# Altium schematic sheet DDR_3.SchDoc
size A2
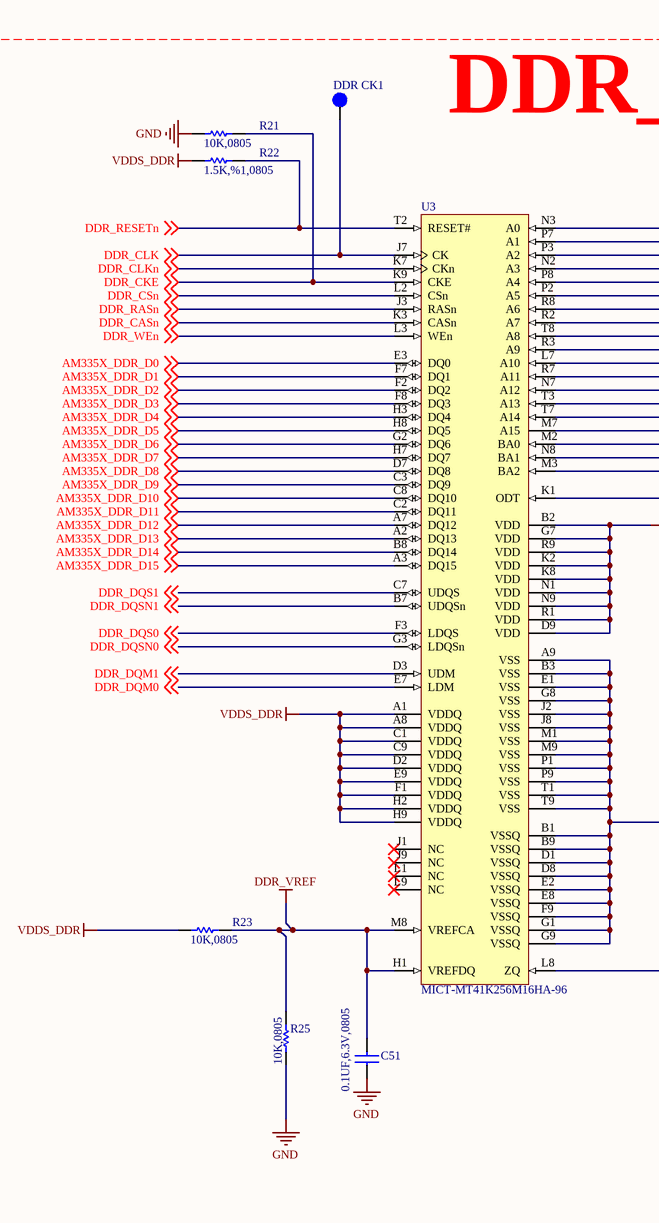
[diagram p0: DDR_3.SchDoc, left]
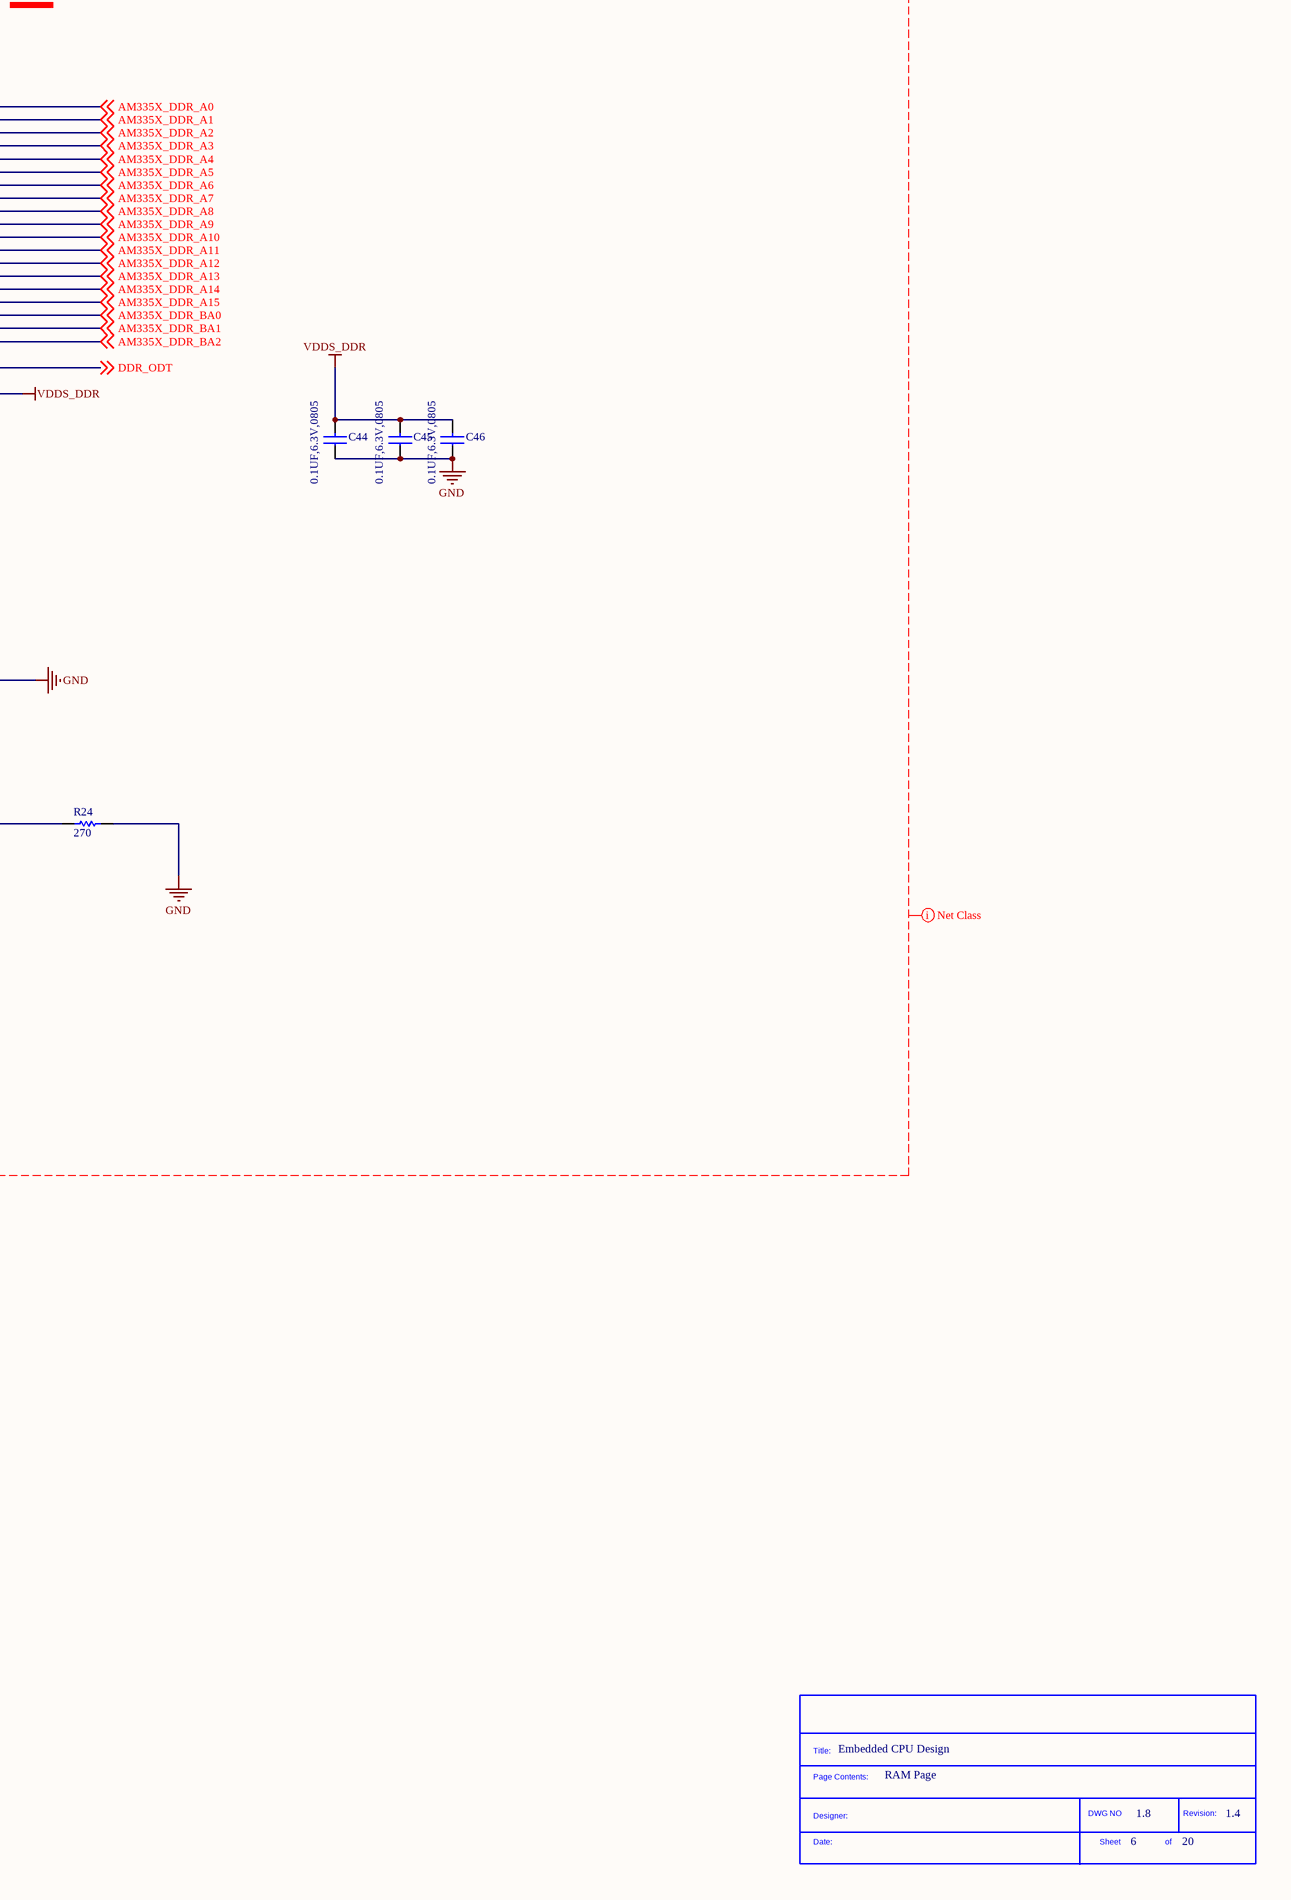
[diagram p1: DDR_3.SchDoc, right]

## Parts
*?  SDTitleBlock  (value not drawn)  (graphical)
C44  0.1UF,6.3V,0805  [0402]
C45  0.1UF,6.3V,0805  [0402]
C46  0.1UF,6.3V,0805  [0402]
C51  0.1UF,6.3V,0805  [0402]
DDR_CK1  Testpoint  [tp_smd1mmcircle]  (value not drawn)
R21  10K,0805  [0402]
R22  1.5K,%1,0805  [0402]
R23  10K,0805  [0402]
R24  270  [0402]
R25  10K,0805  [0402]
U3  MICT-MT41K256M16HA-96  [MICT-HA-96]

## Nets
DDR_VREF: C51.2 R23.2 R25.2 U3.H1(VREFDQ) U3.M8(VREFCA)
GND: C44.1 C45.1 C46.1 C51.1 R21.1 R24.2 R25.1 U3.A9(VSS) U3.B1(VSSQ) U3.B3(VSS) U3.B9(VSSQ) U3.D1(VSSQ) U3.D8(VSSQ) U3.E1(VSS) U3.E2(VSSQ) U3.E8(VSSQ) U3.F9(VSSQ) U3.G1(VSSQ) U3.G8(VSS) U3.G9(VSSQ) U3.J2(VSS) U3.J8(VSS) U3.M1(VSS) U3.M9(VSS) U3.P1(VSS) U3.P9(VSS) U3.T1(VSS) U3.T9(VSS)
VDDS_DDR: C44.2 C45.2 C46.2 R22.2 R23.1 U3.A1(VDDQ) U3.A8(VDDQ) U3.B2(VDD) U3.C1(VDDQ) U3.C9(VDDQ) U3.D2(VDDQ) U3.D9(VDD) U3.E9(VDDQ) U3.F1(VDDQ) U3.G7(VDD) U3.H2(VDDQ) U3.H9(VDDQ) U3.K2(VDD) U3.K8(VDD) U3.N1(VDD) U3.N9(VDD) U3.R1(VDD) U3.R9(VDD)
AM335X_DDR_A0: U3.N3(A0) ; off-sheet AM335X_DDR_A0
AM335X_DDR_A1: U3.P7(A1) ; off-sheet AM335X_DDR_A1
AM335X_DDR_A2: U3.P3(A2) ; off-sheet AM335X_DDR_A2
AM335X_DDR_A3: U3.N2(A3) ; off-sheet AM335X_DDR_A3
AM335X_DDR_A4: U3.P8(A4) ; off-sheet AM335X_DDR_A4
AM335X_DDR_A5: U3.P2(A5) ; off-sheet AM335X_DDR_A5
AM335X_DDR_A6: U3.R8(A6) ; off-sheet AM335X_DDR_A6
AM335X_DDR_A7: U3.R2(A7) ; off-sheet AM335X_DDR_A7
AM335X_DDR_A8: U3.T8(A8) ; off-sheet AM335X_DDR_A8
AM335X_DDR_A9: U3.R3(A9) ; off-sheet AM335X_DDR_A9
AM335X_DDR_A10: U3.L7(A10) ; off-sheet AM335X_DDR_A10
AM335X_DDR_A11: U3.R7(A11) ; off-sheet AM335X_DDR_A11
AM335X_DDR_A12: U3.N7(A12) ; off-sheet AM335X_DDR_A12
AM335X_DDR_A13: U3.T3(A13) ; off-sheet AM335X_DDR_A13
AM335X_DDR_A14: U3.T7(A14) ; off-sheet AM335X_DDR_A14
AM335X_DDR_A15: U3.M7(A15) ; off-sheet AM335X_DDR_A15
AM335X_DDR_BA0: U3.M2(BA0) ; off-sheet AM335X_DDR_BA0
AM335X_DDR_BA1: U3.N8(BA1) ; off-sheet AM335X_DDR_BA1
AM335X_DDR_BA2: U3.M3(BA2) ; off-sheet AM335X_DDR_BA2
AM335X_DDR_D0: U3.E3(DQ0) ; off-sheet AM335X_DDR_D0
AM335X_DDR_D1: U3.F7(DQ1) ; off-sheet AM335X_DDR_D1
AM335X_DDR_D2: U3.F2(DQ2) ; off-sheet AM335X_DDR_D2
AM335X_DDR_D3: U3.F8(DQ3) ; off-sheet AM335X_DDR_D3
AM335X_DDR_D4: U3.H3(DQ4) ; off-sheet AM335X_DDR_D4
AM335X_DDR_D5: U3.H8(DQ5) ; off-sheet AM335X_DDR_D5
AM335X_DDR_D6: U3.G2(DQ6) ; off-sheet AM335X_DDR_D6
AM335X_DDR_D7: U3.H7(DQ7) ; off-sheet AM335X_DDR_D7
AM335X_DDR_D8: U3.D7(DQ8) ; off-sheet AM335X_DDR_D8
AM335X_DDR_D9: U3.C3(DQ9) ; off-sheet AM335X_DDR_D9
AM335X_DDR_D10: U3.C8(DQ10) ; off-sheet AM335X_DDR_D10
AM335X_DDR_D11: U3.C2(DQ11) ; off-sheet AM335X_DDR_D11
AM335X_DDR_D12: U3.A7(DQ12) ; off-sheet AM335X_DDR_D12
AM335X_DDR_D13: U3.A2(DQ13) ; off-sheet AM335X_DDR_D13
AM335X_DDR_D14: U3.B8(DQ14) ; off-sheet AM335X_DDR_D14
AM335X_DDR_D15: U3.A3(DQ15) ; off-sheet AM335X_DDR_D15
DDR_CASn: U3.K3(CASn) ; off-sheet DDR_CASn
DDR_CKE: R21.2 U3.K9(CKE) ; off-sheet DDR_CKE
DDR_CLK: DDR_CK1.1 U3.J7(CK) ; off-sheet DDR_CLK
DDR_CLKn: U3.K7(CKn) ; off-sheet DDR_CLKn
DDR_CSn: U3.L2(CSn) ; off-sheet DDR_CSn
DDR_DQM0: U3.E7(LDM) ; off-sheet DDR_DQM0
DDR_DQM1: U3.D3(UDM) ; off-sheet DDR_DQM1
DDR_DQS0: U3.F3(LDQS) ; off-sheet DDR_DQS0
DDR_DQS1: U3.C7(UDQS) ; off-sheet DDR_DQS1
DDR_DQSN0: U3.G3(LDQSn) ; off-sheet DDR_DQSN0
DDR_DQSN1: U3.B7(UDQSn) ; off-sheet DDR_DQSN1
DDR_ODT: U3.K1(ODT) ; off-sheet DDR_ODT
DDR_RASn: U3.J3(RASn) ; off-sheet DDR_RASn
DDR_RESETn: R22.1 U3.T2(RESET#) ; off-sheet DDR_RESETn
DDR_WEn: U3.L3(WEn) ; off-sheet DDR_WEn
NetR24_1: R24.1 U3.L8(ZQ)

Not connected (* = marked no-connect by the designer): U3 J1(NC)* J9(NC)* L1(NC)* L9(NC)*

## Layout directives
net class DDR_3: AM335X_DDR_A0, AM335X_DDR_A1, AM335X_DDR_A2, AM335X_DDR_A3, AM335X_DDR_A4, AM335X_DDR_A5, AM335X_DDR_A6, AM335X_DDR_A7, AM335X_DDR_A8, AM335X_DDR_A9, AM335X_DDR_A10, AM335X_DDR_A11, AM335X_DDR_A12, AM335X_DDR_A13, AM335X_DDR_A14, AM335X_DDR_A15, AM335X_DDR_BA0, AM335X_DDR_BA1, AM335X_DDR_BA2, AM335X_DDR_D0, AM335X_DDR_D1, AM335X_DDR_D2, AM335X_DDR_D3, AM335X_DDR_D4, AM335X_DDR_D5, AM335X_DDR_D6, AM335X_DDR_D7, AM335X_DDR_D8, AM335X_DDR_D9, AM335X_DDR_D10, AM335X_DDR_D11, AM335X_DDR_D12, AM335X_DDR_D13, AM335X_DDR_D14, AM335X_DDR_D15, DDR_CASn, DDR_CKE, DDR_CLK, DDR_CLKn, DDR_CSn, DDR_DQM0, DDR_DQM1, DDR_DQS0, DDR_DQS1, DDR_DQSN0, DDR_DQSN1, DDR_ODT, DDR_RASn, DDR_RESETn, DDR_VREF, DDR_WEn, GND, VDDS_DDR

## Notes on the sheet
- DDR_3
- Embedded CPU Design
- RAM Page
- 6
- 1.8
- 20
- 1.4
- (in symbol SDTitleBlock) Title:; Page Contents:; Designer:; DWG NO; Revision:; Date:; Sheet; of

## Library data of the parts
C44-C46 C51 = 0.1UF,6.3V,0805: CAP CER 0.1UF 6.3V 10% X7R 0805; Manufacturer: Kemet; Manufacturer Part Number: C0805C104K9RACTU; Capacitance: 0.1µF; Supplier 1: Digi-Key; RoHS: RoHS Compliant; Category: Capacitors; Stock 1: 19204; Pricing 1: 1=0.12, 10=0.083, 25=0.062, 50=0.0476, 100=0.0392, 250=0.03304, 1000=0.02228 (USD); Packaging: Digi-Reel®; Tolerance: ±10%; Voltage - Rated: 6.3V; Temperature Coefficient: X7R; Mounting Type: Surface Mount, MLCC; Operating Temperature: -55°C ~ 125°C; Applications: General Purpose; Ratings: -; Package / Case: 0805 (2012 Metric); Size / Dimension: 0.079" L x 0.049" W (2.00mm x 1.25mm); Height - Seated (Max): -; Thickness (Max): 0.035" (0.88mm); Lead Spacing: -; Features: -; Lead Style: -; ComponentLink1URL: http://www.kemet.com/docfinder?Partnumber=C0805C104K9RACTU; ComponentLink1Description: http://www.kemet.com/docfinder?Partnumber=C0805C104K9RACTU; Supplier Part Number 1: 399-9155-6-ND
DDR_CK1 = Testpoint_SMD1mmCircle: Testpoint SMD; PartName: TestpointSMD1mmCircle; TIIntPartnumber: 2H0046; DescriptiveText: Testpoint SMD 1mm circle pad; Cost100: 0; Mfr: N/A; MfrNum: N/A; Vendor: N/A; Cost10K: 0; Descriptive_Text: Testpoint SMD 1mm circle pad
R21 R23 R25 = 10K,0805: BOURNS - CR0805-FX-1002GLF - RESISTOR, 10K, 0.125W, 1%; Product Range: BOURNS - CR Series; Resistance: 10; Power Rating: 125; Resistor Case Style: 0805 [2012 Metric]; Resistor Element Material: Thick Film; Temperature Coefficient: ± 100; Voltage Rating: 150; SVHC: No SVHC (16-Jun-2014); Resistor Mounting: SMD<!--FANDB--><div class="features-and-benefits-container"></div>; Power (Watts): 0.125W, 1/8W; Manufacturer: BOURNS; Manufacturer Part Number: CR0805-FX-1002GLF; RoHS: YES; Resistance Tolerance: ± 1%; Packaging: Cut Tape; MSL: MSL 1 - Unlimited; ComponentLink1URL: http://www.farnell.com/datasheets/1845293.pdf; ComponentLink1Description: http://www.farnell.com/datasheets/1845293.pdf; Supplier 1: Digi-Key; Category: Resistors; Stock 1: 1116166; Pricing 1: 1=0.1, 10=0.029, 50=0.0162, 100=0.0123, 250=0.00912, 500=0.00672, 1000=0.00448, 2500=0.00378 (USD); Resistance (Ohms): 10k; Tolerance: ±1%; Composition: Thick Film; Features: -; Operating Temperature: -55°C ~ 155°C; Package / Case: 0805 (2012 Metric); Supplier Device Package: 0805; Size / Dimension: 0.079" L x 0.049" W (2.00mm x 1.25mm); Height: 0.026" (0.65mm); Number of Terminations: 2; ComponentLink2URL: http://www.seielect.com/Catalog/SEI-RMCF_RMCP.pdf; ComponentLink2Description: http://www.seielect.com/Catalog/SEI-RMCF_RMCP.pdf; Supplier Part Number 1: RMCF0805FT10K0CT-ND
R22 = 1.5K,%1,0805: MULTICOMP - MCPWR05FTEW1501 - RESISTOR, 0805, 1.5K 1%,  0.125W; Product Range: MULTICOMP - MCPWR Series; Resistance: 1.5; Power Rating: 125; Resistor Case Style: 0805 [2012 Metric]; Resistor Element Material: Thick Film; Temperature Coefficient: ± 100; Voltage Rating: 150; SVHC: No SVHC (16-Jun-2014); Resistor Mounting: SMD<!--FANDB--><div class="features-and-benefits-container"></div>; Power (Watts): 0.125W, 1/8W; Manufacturer: MULTICOMP; Manufacturer Part Number: MCPWR05FTEW1501; RoHS: Y-EX; Resistance Tolerance: ± 1%; Packaging: Cut Tape; MSL: -; ComponentLink1URL: http://www.farnell.com/datasheets/1718729.pdf; ComponentLink1Description: http://www.farnell.com/datasheets/1718729.pdf; ComponentLink2URL: http://www.farnell.com/cad/1638340.zip; ComponentLink2Description: http://www.farnell.com/cad/1638340.zip; Supplier 1: Digi-Key; Category: Resistors; Stock 1: 277366; Pricing 1: 1=0.1, 50=0.0288, 100=0.0219, 250=0.01624, 500=0.012, 1000=0.008, 2500=0.00675 (USD); Resistance (Ohms): 1.5k; Tolerance: ±1%; Composition: Thick Film; Features: Automotive AEC-Q200; Operating Temperature: -55°C ~ 155°C; Package / Case: 0805 (2012 Metric); Supplier Device Package: 0805; Size / Dimension: 0.079" L x 0.049" W (2.00mm x 1.25mm); Height: 0.028" (0.70mm); Number of Terminations: 2; ComponentLink3URL: http://industrial.panasonic.com/www-cgi/jvcr13pz.cgi?E+PZ+3+AOA0002+ERJ6ENF1501V+7+WW; ComponentLink3Description: http://industrial.panasonic.com/www-cgi/jvcr13pz.cgi?E+PZ+3+AOA0002+ERJ6ENF1501V+7+WW; Supplier Part Number 1: P1.50KCCT-ND
R24 = 1K,0805: BOURNS - CR0805-FX-1001ELF - RESISTOR, 1K, 0.125W, 1%; Product Range: BOURNS - CR Series; Resistance: 1; Power Rating: 125; Resistor Case Style: 0805 [2012 Metric]; Resistor Element Material: Thick Film; Temperature Coefficient: ± 100; Voltage Rating: 150; SVHC: No SVHC (16-Jun-2014); Resistor Mounting: SMD<!--FANDB--><div class="features-and-benefits-container"></div>; Power (Watts): 0.125W, 1/8W; Manufacturer: BOURNS; Manufacturer Part Number: CR0805-FX-1001ELF; RoHS: YES; Resistance Tolerance: ± 1%; Packaging: Cut Tape; MSL: MSL 1 - Unlimited; ComponentLink1URL: http://www.farnell.com/datasheets/1845293.pdf; ComponentLink1Description: http://www.farnell.com/datasheets/1845293.pdf; Supplier 1: Digi-Key; Category: Resistors; Stock 1: 2060902; Pricing 1: 1=0.1, 50=0.0288, 100=0.0219, 250=0.01624, 500=0.012, 1000=0.008, 2500=0.00675 (USD); Resistance (Ohms): 1k; Tolerance: ±1%; Composition: Thick Film; Features: Automotive AEC-Q200; Operating Temperature: -55°C ~ 155°C; Package / Case: 0805 (2012 Metric); Supplier Device Package: 0805; Size / Dimension: 0.079" L x 0.049" W (2.00mm x 1.25mm); Height: 0.028" (0.70mm); Number of Terminations: 2; ComponentLink2URL: http://industrial.panasonic.com/www-cgi/jvcr13pz.cgi?E+PZ+3+AOA0002+ERJ6ENF1001V+7+WW; ComponentLink2Description: http://industrial.panasonic.com/www-cgi/jvcr13pz.cgi?E+PZ+3+AOA0002+ERJ6ENF1001V+7+WW; Supplier Part Number 1: P1.00KCCT-ND